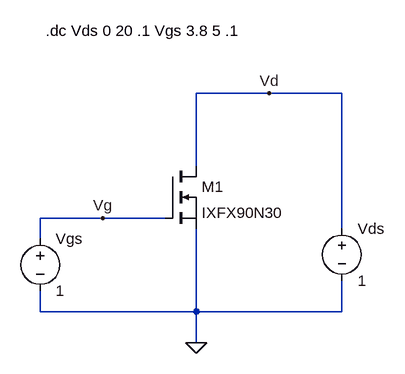
[diagram p0: schematic nMosfet_Curves.asc]
nMosfet_Curves.asc, the LTspice schematic file:
Version 4
SHEET 1 880 680
WIRE 368 0 256 0
WIRE 480 0 368 0
WIRE 256 112 256 0
WIRE 112 192 16 192
WIRE 208 192 112 192
WIRE 480 208 480 0
WIRE 16 224 16 192
WIRE 16 336 16 304
WIRE 256 336 256 208
WIRE 256 336 16 336
WIRE 480 336 480 288
WIRE 480 336 256 336
WIRE 256 384 256 336
FLAG 256 384 0
FLAG 112 192 Vg
FLAG 368 0 Vd
SYMBOL nmos 208 112 R0
SYMATTR InstName M1
SYMATTR Value IXFX90N30
SYMBOL voltage 16 208 R0
WINDOW 123 0 0 Left 0
WINDOW 39 0 0 Left 0
SYMATTR InstName Vgs
SYMATTR Value 1
SYMBOL voltage 480 192 R0
WINDOW 123 0 0 Left 0
WINDOW 39 0 0 Left 0
SYMATTR InstName Vds
SYMATTR Value 1
TEXT 24 -96 Left 2 !.dc Vds 0 20 .1 Vgs 3.8 5 .1

The netlist it stands for:
* nMosfet_Curves.asc
M1 Vd Vg 0 0 IXFX90N30
Vgs Vg 0 1
Vds Vd 0 1
.model NMOS NMOS
.model PMOS PMOS
.lib standard.mos
.dc Vds 0 20 .1 Vgs 3.8 5 .1
.backanno
.end